# Altium schematic sheet DigitalSupplies.SchDoc
size 420 x 297 mm; SheetNumber: 2; SheetTotal: 4
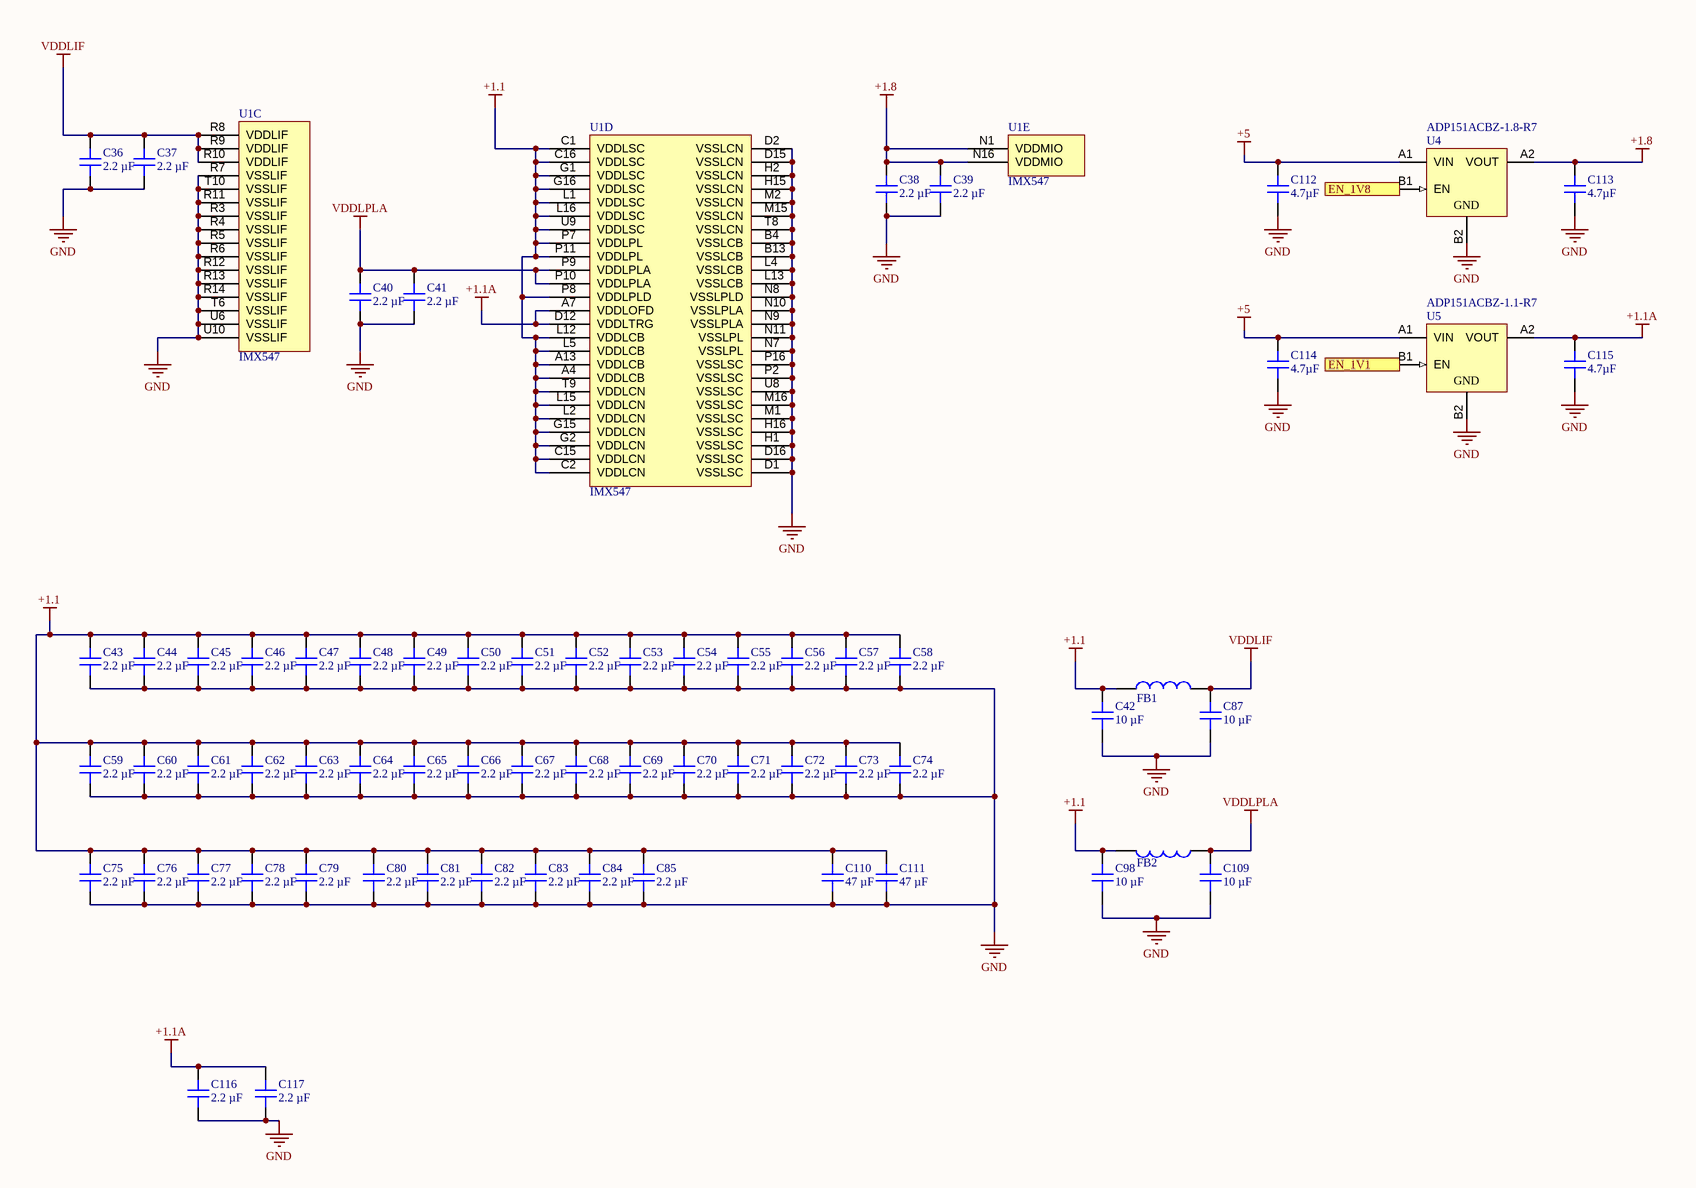
[diagram p0: DigitalSupplies.SchDoc]

## Parts
C36  2.2 µF  [FP-GRM033-0_09-MFG]
C37  2.2 µF  [FP-GRM033-0_09-MFG]
C38  2.2 µF  [FP-GRM033-0_09-MFG]
C39  2.2 µF  [FP-GRM033-0_09-MFG]
C40  2.2 µF  [FP-GRM033-0_09-MFG]
C41  2.2 µF  [FP-GRM033-0_09-MFG]
C42  10 µF  [FP-GRM155-0_15-MFG]
C43  2.2 µF  [FP-GRM033-0_09-MFG]
C44  2.2 µF  [FP-GRM033-0_09-MFG]
C45  2.2 µF  [FP-GRM033-0_09-MFG]
C46  2.2 µF  [FP-GRM033-0_09-MFG]
C47  2.2 µF  [FP-GRM033-0_09-MFG]
C48  2.2 µF  [FP-GRM033-0_09-MFG]
C49  2.2 µF  [FP-GRM033-0_09-MFG]
C50  2.2 µF  [FP-GRM033-0_09-MFG]
C51  2.2 µF  [FP-GRM033-0_09-MFG]
C52  2.2 µF  [FP-GRM033-0_09-MFG]
C53  2.2 µF  [FP-GRM033-0_09-MFG]
C54  2.2 µF  [FP-GRM033-0_09-MFG]
C55  2.2 µF  [FP-GRM033-0_09-MFG]
C56  2.2 µF  [FP-GRM033-0_09-MFG]
C57  2.2 µF  [FP-GRM033-0_09-MFG]
C58  2.2 µF  [FP-GRM033-0_09-MFG]
C59  2.2 µF  [FP-GRM033-0_09-MFG]
C60  2.2 µF  [FP-GRM033-0_09-MFG]
C61  2.2 µF  [FP-GRM033-0_09-MFG]
C62  2.2 µF  [FP-GRM033-0_09-MFG]
C63  2.2 µF  [FP-GRM033-0_09-MFG]
C64  2.2 µF  [FP-GRM033-0_09-MFG]
C65  2.2 µF  [FP-GRM033-0_09-MFG]
C66  2.2 µF  [FP-GRM033-0_09-MFG]
C67  2.2 µF  [FP-GRM033-0_09-MFG]
C68  2.2 µF  [FP-GRM033-0_09-MFG]
C69  2.2 µF  [FP-GRM033-0_09-MFG]
C70  2.2 µF  [FP-GRM033-0_09-MFG]
C71  2.2 µF  [FP-GRM033-0_09-MFG]
C72  2.2 µF  [FP-GRM033-0_09-MFG]
C73  2.2 µF  [FP-GRM033-0_09-MFG]
C74  2.2 µF  [FP-GRM033-0_09-MFG]
C75  2.2 µF  [FP-GRM033-0_09-MFG]
C76  2.2 µF  [FP-GRM033-0_09-MFG]
C77  2.2 µF  [FP-GRM033-0_09-MFG]
C78  2.2 µF  [FP-GRM033-0_09-MFG]
C79  2.2 µF  [FP-GRM033-0_09-MFG]
C80  2.2 µF  [FP-GRM033-0_09-MFG]
C81  2.2 µF  [FP-GRM033-0_09-MFG]
C82  2.2 µF  [FP-GRM033-0_09-MFG]
C83  2.2 µF  [FP-GRM033-0_09-MFG]
C84  2.2 µF  [FP-GRM033-0_09-MFG]
C85  2.2 µF  [FP-GRM033-0_09-MFG]
C87  10 µF  [FP-GRM155-0_15-MFG]
C98  10 µF  [FP-GRM155-0_15-MFG]
C109  10 µF  [FP-GRM155-0_15-MFG]
C110  47 µF  [FP-GRM188-0_15-MFG]
C111  47 µF  [FP-GRM188-0_15-MFG]
C112  4.7µF  [FP-GRM155-0_15-MFG]
C113  4.7µF  [FP-GRM155-0_15-MFG]
C114  4.7µF  [FP-GRM155-0_15-MFG]
C115  4.7µF  [FP-GRM155-0_15-MFG]
C116  2.2 µF  [FP-GRM033-0_09-MFG]
C117  2.2 µF  [FP-GRM033-0_09-MFG]
FB1  742843122  [WE-CBF HF_0402_High Current]  (value not drawn)
FB2  742843122  [WE-CBF HF_0402_High Current]  (value not drawn)
U1  IMX547  [LGA230C100P16X17_1680X2000X260]  (parts C,D,E of 11)
U4  ADP151ACBZ-1.8-R7  [ADI-CB-4-3]
U5  ADP151ACBZ-1.1-R7  [ADI-CB-4-3]

## Ports
EN_1V1, EN_1V8 (in)

## Nets
+1.1: C42.2 C43.2 C44.2 C45.2 C46.2 C47.2 C48.2 C49.2 C50.2 C51.2 C52.2 C53.2 C54.2 C55.2 C56.2 C57.2 C58.2 C59.2 C60.2 C61.2 C62.2 C63.2 C64.2 C65.2 C66.2 C67.2 C68.2 C69.2 C70.2 C71.2 C72.2 C73.2 C74.2 C75.2 C76.2 C77.2 C78.2 C79.2 C80.2 C81.2 C82.2 C83.2 C84.2 C85.2 C98.2 C110.2 C111.2 FB1.1 FB2.2 U1.A4(VDDLCB) U1.A13(VDDLCB) U1.C1(VDDLSC) U1.C2(VDDLCN) U1.C15(VDDLCN) U1.C16(VDDLSC) U1.G1(VDDLSC) U1.G2(VDDLCN) U1.G15(VDDLCN) U1.G16(VDDLSC) U1.L1(VDDLSC) U1.L2(VDDLCN) U1.L5(VDDLCB) U1.L12(VDDLCB) U1.L15(VDDLCN) U1.L16(VDDLSC) U1.P7(VDDLPL) U1.P8(VDDLPLD) U1.P11(VDDLPL) U1.T9(VDDLCN) U1.U9(VDDLSC)
+1.1A: C115.2 C116.2 C117.2 U1.A7(VDDLOFD) U1.D12(VDDLTRG) U5.A2(VOUT)
+1.8: C38.2 C39.2 C113.2 U1.N1(VDDMIO) U1.N16(VDDMIO) U4.A2(VOUT)
+5: C112.2 C114.2 U4.A1(VIN) U5.A1(VIN)
GND: C36.1 C37.1 C38.1 C39.1 C40.1 C41.1 C42.1 C43.1 C44.1 C45.1 C46.1 C47.1 C48.1 C49.1 C50.1 C51.1 C52.1 C53.1 C54.1 C55.1 C56.1 C57.1 C58.1 C59.1 C60.1 C61.1 C62.1 C63.1 C64.1 C65.1 C66.1 C67.1 C68.1 C69.1 C70.1 C71.1 C72.1 C73.1 C74.1 C75.1 C76.1 C77.1 C78.1 C79.1 C80.1 C81.1 C82.1 C83.1 C84.1 C85.1 C87.1 C98.1 C109.1 C110.1 C111.1 C112.1 C113.1 C114.1 C115.1 C116.1 C117.1 U1.B4(VSSLCB) U1.B13(VSSLCB) U1.D1(VSSLSC) U1.D2(VSSLCN) U1.D15(VSSLCN) U1.D16(VSSLSC) U1.H1(VSSLSC) U1.H2(VSSLCN) U1.H15(VSSLCN) U1.H16(VSSLSC) U1.L4(VSSLCB) U1.L13(VSSLCB) U1.M1(VSSLSC) U1.M2(VSSLCN) U1.M15(VSSLCN) U1.M16(VSSLSC) U1.N7(VSSLPL) U1.N8(VSSLPLD) U1.N9(VSSLPLA) U1.N10(VSSLPLA) U1.N11(VSSLPL) U1.P2(VSSLSC) U1.P16(VSSLSC) U1.R3(VSSLIF) U1.R4(VSSLIF) U1.R5(VSSLIF) U1.R6(VSSLIF) U1.R7(VSSLIF) U1.R11(VSSLIF) U1.R12(VSSLIF) U1.R13(VSSLIF) U1.R14(VSSLIF) U1.T6(VSSLIF) U1.T8(VSSLCN) U1.T10(VSSLIF) U1.U6(VSSLIF) U1.U8(VSSLSC) U1.U10(VSSLIF) U4.B2(GND) U5.B2(GND)
VDDLIF: C36.2 C37.2 C87.2 FB1.2 U1.R8(VDDLIF) U1.R9(VDDLIF) U1.R10(VDDLIF)
VDDLPLA: C40.2 C41.2 C109.2 FB2.1 U1.P9(VDDLPLA) U1.P10(VDDLPLA)
EN_1V1: U5.B1(EN) ; port EN_1V1
EN_1V8: U4.B1(EN) ; port EN_1V8

## Notes on the sheet
- DWG NO:
- REVISION
- REV:
- DESCRIPTION
- DATE
- APPROVED
- ENG:
- APPROVALS
- PROJECT
- DSN:
- CHK:
- REFERENCE DOCUMENTS
- PROJECT REVISION:
- TITLE
- SimulaVR
- DOCUMENT REVISION:
- DESIGN ITEM:
- BOM:
- FAB DWG:
- PCB DWG:
- ASSY DWG:
- SCALE:
- A3
- SIZE
- CAGE CODE
- FILE NAME
- DWG NO.
- SHEET
- OF
- REV

## Library data of the parts
C36-C41 C43-C85 C116 C117 = GRM033R60J225ME01D: CAP CER 2.2UF 6.3V X5R 0201; manufacturer: Murata Electronics; Tolerance: ±20%; Part Number: GRM033R60J225ME01D; Value: 2.2 µF; Applications: General Purpose; Capacitance: 2.2 µF; componentlink1description: Datasheet; componentlink1url: https://search.murata.co.jp/Ceramy/image/img/A01X/G101/ENG/GRM033R60J225ME01-01A.pdf; componentlink2description: DigiKey Link; componentlink2url: https://www.digikey.com/en/products/detail/murata-electronics/GRM033R60J225ME01D/16033628; Device Package: 0201 (0603 Metric); lastupdated: 19.09.2022 12:54:17; Lifecycle Status: Active; Minimum Order: 1; Mounting Type: Surface Mount, MLCC; Operating Temperature: -55°C ~ 85°C; Package / Case: 0201 (0603 Metric); packaging: TapeAndReel; partid: 41005; Part Status: Active; price: 0.02; series: GRM; Size / Dimension: 0.024" L x 0.012" W (0.60mm x 0.30mm); Supplier 1: DigiKey; Supplier Part Number 1: 490-GRM033R60J225ME01DCT-ND; Temperature Coefficient: X5R; Thickness (Max): 0.015" (0.39mm); Voltage - Rated: 6.3V
C42 C87 C98 C109 = GRM155R60J106ME15D: CAP CER 10UF 6.3V X5R 0402; manufacturer: Murata Electronics; Tolerance: ±20%; Part Number: GRM155R60J106ME15D; Value: 10 µF; Applications: General Purpose; Capacitance: 10 µF; componentlink1description: Datasheet; componentlink1url: https://www.murata.com/~/media/webrenewal/support/library/catalog/products/capacitor/mlcc/c02e.ashx?la=en-us; componentlink2description: DigiKey Link; componentlink2url: https://www.digikey.com/en/products/detail/murata-electronics/GRM155R60J106ME15D/5877401; Device Package: 0402 (1005 Metric); lastupdated: 19.09.2022 12:57:20; Lifecycle Status: Active; Minimum Order: 1; Mounting Type: Surface Mount, MLCC; Operating Temperature: -55°C ~ 85°C; Package / Case: 0402 (1005 Metric); packaging: TapeAndReel; partid: 6754; Part Status: Active; price: 0.02; series: GRM; Size / Dimension: 0.039" L x 0.020" W (1.00mm x 0.50mm); Supplier 1: DigiKey; Supplier Part Number 1: 490-13238-1-ND; Temperature Coefficient: X5R; Thickness (Max): 0.026" (0.65mm); Voltage - Rated: 6.3V
C110 C111 = GRM188R60J476ME01D: CAP CER 47UF 6.3V X5R 0603; manufacturer: Murata Electronics; Tolerance: ±20%; Part Number: GRM188R60J476ME01D; Value: 47 µF; Applications: General Purpose; Capacitance: 47 µF; componentlink2description: DigiKey Link; componentlink2url: https://www.digikey.com/en/products/detail/murata-electronics/GRM188R60J476ME01D/13996874; Device Package: 0603 (1608 Metric); lastupdated: 5/20/2022 2:38:45 PM; Lifecycle Status: Active; Minimum Order: 1; Mounting Type: Surface Mount, MLCC; Operating Temperature: -55°C ~ 85°C; Package / Case: 0603 (1608 Metric); packaging: TapeAndReel; partid: 44498; Part Status: Active; price: 0.10; series: GRM; Size / Dimension: 0.063" L x 0.031" W (1.60mm x 0.80mm); Supplier 1: DigiKey; Supplier Part Number 1: 490-GRM188R60J476ME01DCT-ND; Temperature Coefficient: X5R; Thickness (Max): 0.039" (1.00mm); Voltage - Rated: 6.3V
C112-C115 = GRM155R61A475MEAAD: CAP CER 4.7UF 10V X5R 0402; Manufacturer: Murata Electronics; Tolerance: ±20%; Part Number: GRM155R61A475MEAAD; Value: 4.7µF; Applications: General Purpose; Capacitance: 4.7µF; ComponentLink1Description: Datasheet; ComponentLink1URL: https://search.murata.co.jp/Ceramy/image/img/A01X/G101/ENG/GRM155R61A475MEAA-01.pdf; ComponentLink2Description: DigiKey Link; ComponentLink2URL: https://www.digikey.com/en/products/detail/murata-electronics/GRM155R61A475MEAAD/6234735; Device Package: 0402 (1005 Metric); LastUpdated: 2/8/2022 12:26:50 PM; Lifecycle Status: Active; Minimum Order: 1; Mounting Type: Surface Mount, MLCC; Operating Temperature: -55°C ~ 85°C; Package / Case: 0402 (1005 Metric); Packaging: TapeAndReel; PartId: 6746; Part Status: Active; Price: 0.03; Series: GRM; Size / Dimension: 0.039" L x 0.020" W (1.00mm x 0.50mm); Supplier 1: DigiKey; Supplier Part Number 1: 490-14306-1-ND; Temperature Coefficient: X5R; Thickness (Max): 0.026" (0.65mm); Voltage - Rated: 10V
FB1 FB2 = CMP-015-000002-1: WE-CBF HF SMT High Frequency EMI Suppression Ferrite Bead, size 0402, 220O, 0.8A; Manufacturer: Wurth Elektronik; Impedance @1GHz: 300O; Impedance Max Test Condition: 750MHz; Case/Size Code: 0402; Type: High Current; Impedance Max: 400O; DC Resistance: 0.25O; ComponentLink2Description: Datasheet Link; Impedance @100MHz: 220O; Category: Ferrites for PCB Assembly; ComponentLink1Description: Website Link; ComponentLink2URL: https://www.we-online.com/redexpert/spec/742843122?ad; Packaging: Tape and Reel; Design Item ID: 742843122; Rated Current: 0.8A; Manufacturer Part Number: 742843122; Match Code: WE-CBF HF; Length: 1mm; Pin Count: 2; Height: 0.5mm; Width: 0.5mm; Operating Temperature Min: -55°C; Mount: Surface Mount; Source: WE-CBF HF.SchLib; Component Type: Standard; ComponentLink1URL: https://www.we-online.com/redexpert/article/742843122?ad; Operating Temperature Max: 125°C
U1 = CMP-001-0000-4: Sony IMX547 sensor
U4 = CMP-0786-00016-1: Ultralow Noise, 200 mA, CMOS Linear Regulator, 2.2 to 5.5 V Vin, 1.8 V Vout, Industrial, 4-pin BGA (CB-4-3), Reel; Manufacturer: Analog Devices; Iout max: 200mA; Vin (max) (V): 5.5; Preset Vout Values (V): 1.8; Vin (min) (V): 2.2; Supply Current IGND @ Small Load: 10uA; ComponentLink3Description: Package Specification; Packing: Reel; Mounting Technology: Surface Mount; ComponentLink1Description: Manufacturer URL; PackageReference: CB-4-3; ComponentLink3URL: http:/www.analog.com/static/imported-files/packages/PKG_PDF/WLCSP(CB)/CB_4_3.pdf; ComponentLink4Description: URL Link1; ComponentLink2URL: http://www.analog.com/static/imported-files/data_sheets/ADP151.pdf; PackageVersion: 011409-A, 01/2009; ComponentLink2Description: Datasheet; PartNumber: ADP151ACBZ-1.8-R7; ComponentLink1URL: http://www.analog.com/en/index.html; PackageDescription: 4-Ball Wafer Level Chip Scale Package, Body 0.76 x 0.76 mm, Pitch 0.4 mm; ComponentLink4URL: Product URL:http://www.analog.com/en/ADP151/productSearch.html; DatasheetVersion: Rev. E
U5 = CMP-0786-00003-1: Ultralow Noise, 200 mA, CMOS Linear Regulator, 2.2 to 5.5 V Vin, 1.1 V Vout, Industrial, 4-pin BGA (CB-4-3), Reel; Manufacturer: Analog Devices; Vin (max) (V): 5.5; Iout max: 200mA; Vin (min) (V): 2.2; Supply Current IGND @ Small Load: 10uA; Preset Vout Values (V): 1.1; ComponentLink1Description: Manufacturer URL; ComponentLink4URL: Product URL:http://www.analog.com/en/ADP151/productSearch.html; ComponentLink3URL: http:/www.analog.com/static/imported-files/packages/PKG_PDF/WLCSP(CB)/CB_4_3.pdf; PackageDescription: 4-Ball Wafer Level Chip Scale Package, Body 0.76 x 0.76 mm, Pitch 0.4 mm; PackageReference: CB-4-3; ComponentLink4Description: URL Link1; DatasheetVersion: Rev. E; PartNumber: ADP151ACBZ-1.1-R7; ComponentLink3Description: Package Specification; ComponentLink2Description: Datasheet; Mounting Technology: Surface Mount; ComponentLink1URL: http://www.analog.com/en/index.html; Packing: Reel; PackageVersion: 011409-A, 01/2009; ComponentLink2URL: http://www.analog.com/static/imported-files/data_sheets/ADP151.pdf